# Altium project PATHOS_ControllerBoardExp.PrjPCB (part 2 of 2)

## Sheet PATHOS_SOM_CAN.SchDoc
size A4; CompanyName: NTB; Organization: NTB Interstate University of Applied; Address1: Werdenbergstrasse 4; Address3: 9471 Buchs; Address4: Switzerland; Organization1: Sciences of Technology Buchs; Size: A4
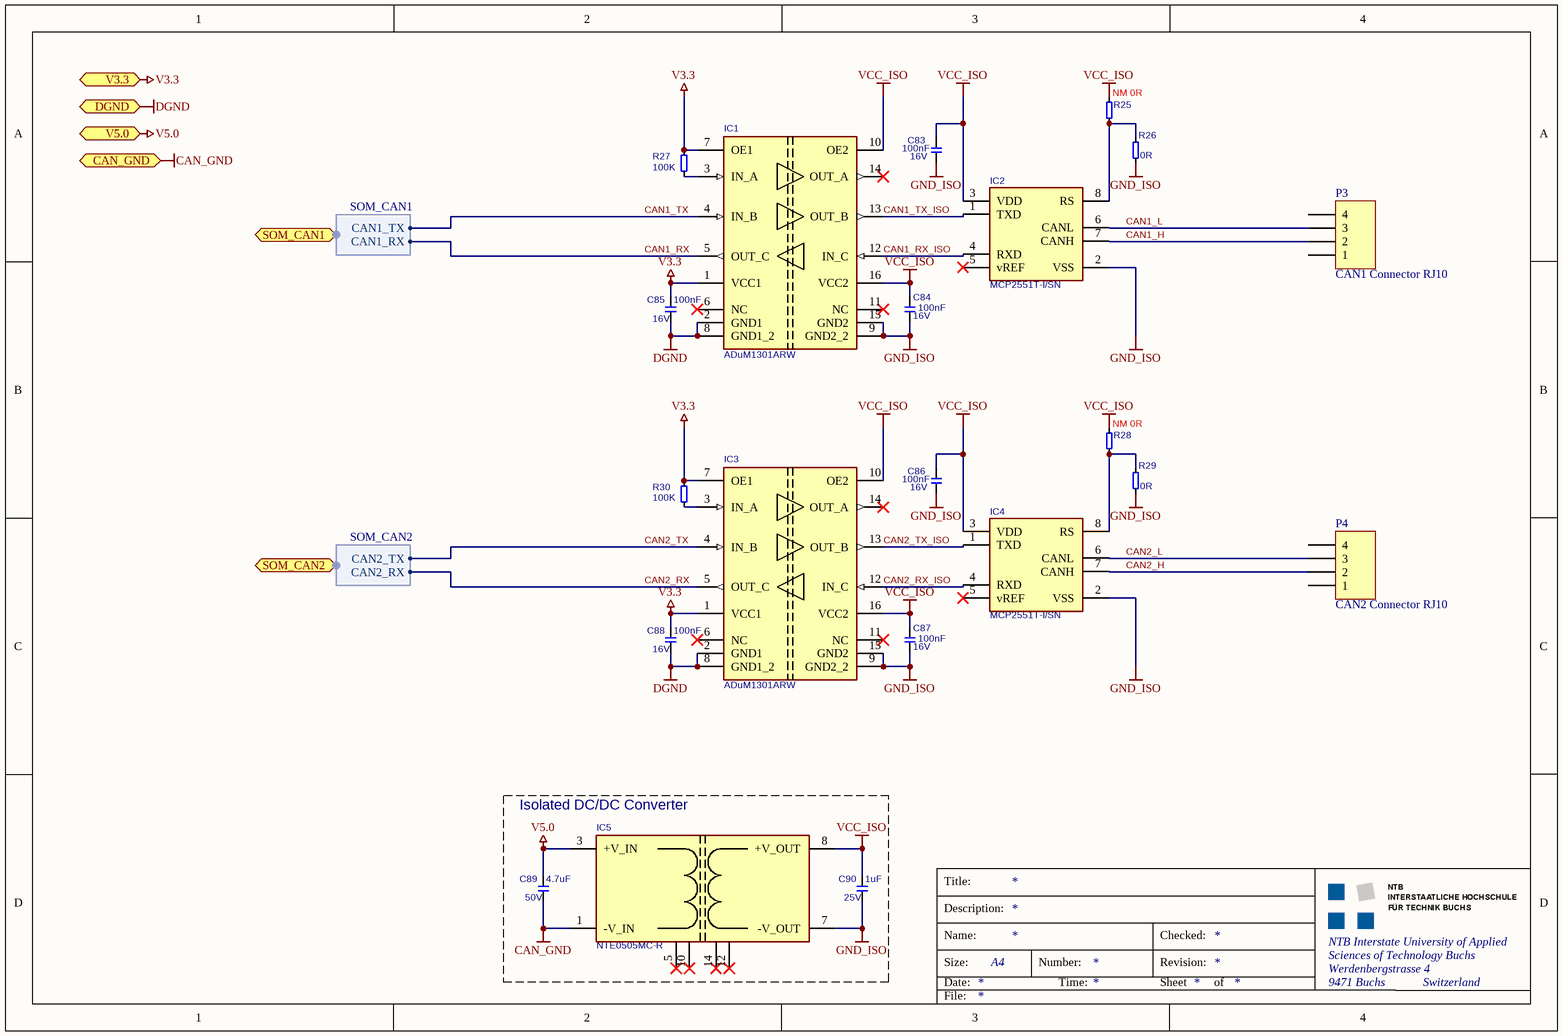
[diagram p12: PATHOS_SOM_CAN.SchDoc]

### Parts
C83  Rating: 16V  [0603_3D]  (hidden comment: 100nF)
C84  Rating: 16V  [0603_3D]  (hidden comment: 100nF)
C85  Rating: 16V  [0603_3D]  (hidden comment: 100nF)
C86  Rating: 16V  [0603_3D]  (hidden comment: 100nF)
C87  Rating: 16V  [0603_3D]  (hidden comment: 100nF)
C88  Rating: 16V  [0603_3D]  (hidden comment: 100nF)
C89  Rating: 50V  [1206]  (hidden comment: 4.7uF)
C90  Rating: 25V  [0603_3D]  (hidden comment: 1uF)
IC1  ADuM1301ARW  [T_AD_ADuM1300ARW]
IC2  MCP2551T-I/SN  [SOIC127P600X173-8N]
IC3  ADuM1301ARW  [T_AD_ADuM1300ARW]
IC4  MCP2551T-I/SN  [SOIC127P600X173-8N]
IC5  NTE0505MC-R  [T_MURATA_NTE0505MC-R]
P3  CAN1 Connector RJ10  [95009-2447]
P4  CAN2 Connector RJ10  [95009-2447]
R25  NM 0R  [0603_3D]
R26  0R  [0603_3D]
R27  100K  [0603_3D]
R28  NM 0R  [0603_3D]
R29  0R  [0603_3D]
R30  100K  [0603_3D]

### Blocks framed on the sheet
Isolated DC/DC Converter: C89 C90 IC5

### Ports
CAN_GND, DGND, SOM_CAN1 (harness SOM_CAN1), SOM_CAN2 (harness SOM_CAN2), V3.3, V5.0

### Harnesses
SOM_CAN1: CAN1_TX, CAN1_RX
SOM_CAN2: CAN2_TX, CAN2_RX

### Nets
CAN_GND: C89.1 IC5.1(-V_IN) ; port CAN_GND
DGND: C85.1 C88.1 IC1.2(GND1) IC1.8(GND1_2) IC3.2(GND1) IC3.8(GND1_2) ; port DGND
GND_ISO: C83.1 C84.1 C86.1 C87.1 C90.1 IC1.9(GND2_2) IC1.15(GND2) IC2.2(VSS) IC3.9(GND2_2) IC3.15(GND2) IC4.2(VSS) IC5.7(-V_OUT) R26.1 R29.1
V3.3: C85.2 C88.2 IC1.1(VCC1) IC1.7(OE1) IC3.1(VCC1) IC3.7(OE1) R27.2 R30.2 ; port V3.3
V5.0: C89.2 IC5.3(+V_IN) ; port V5.0
VCC_ISO: C83.2 C84.2 C86.2 C87.2 C90.2 IC1.10(OE2) IC1.16(VCC2) IC2.3(VDD) IC3.10(OE2) IC3.16(VCC2) IC4.3(VDD) IC5.8(+V_OUT) R25.2 R28.2
CAN1_H: IC2.7(CANH) P3.2
CAN1_L: IC2.6(CANL) P3.3
CAN1_RX: IC1.5(OUT_C) ; port SOM_CAN1.CAN1_RX
CAN1_RX_ISO: IC1.12(IN_C) IC2.4(RXD)
CAN1_TX: IC1.4(IN_B) ; port SOM_CAN1.CAN1_TX
CAN1_TX_ISO: IC1.13(OUT_B) IC2.1(TXD)
CAN2_H: IC4.7(CANH) P4.2
CAN2_L: IC4.6(CANL) P4.3
CAN2_RX: IC3.5(OUT_C) ; port SOM_CAN2.CAN2_RX
CAN2_RX_ISO: IC3.12(IN_C) IC4.4(RXD)
CAN2_TX: IC3.4(IN_B) ; port SOM_CAN2.CAN2_TX
CAN2_TX_ISO: IC3.13(OUT_B) IC4.1(TXD)
NetIC1_3: IC1.3(IN_A) R27.1
NetIC2_8: IC2.8(RS) R25.1 R26.2
NetIC3_3: IC3.3(IN_A) R30.1
NetIC4_8: IC4.8(RS) R28.1 R29.2

Not connected (* = marked no-connect by the designer): IC1 6(NC)* 11(NC)* 14(OUT_A)*; IC2 5(vREF)*; IC3 6(NC)* 11(NC)* 14(OUT_A)*; IC4 5(vREF)*; IC5 5(NC)* 10(NC)* 12(NC)* 14(NC)*; P3 1 4; P4 1 4

### Notes on the sheet
- Title:
- Description:
- Size:
- Date:
- Name:
- Number:
- Time:
- Revision:
- Sheet
- Checked:
- of
- File:

### Library data of the parts
C83-C90 = C-X7R-100nF-16V-10%-0603: Capacitor Ceramic X7R 100nF 16V 10% 0603; Tolerance: 10%; Type: X7R
  C83-C88: Value: 100nF
  C89: Value: 4.7uF
  C90: Value: 1uF
IC1 IC3 = IC-AD-ADuM1301ARW: Digital Isolator; Manufacturer Name: Analog Devices; Manufacturer Part No.: ADuM1301ARW
IC2 IC4 = IC-MC-MCP2551T-I/SN: High speed CAN Transceiver; Manufacturer Name: Microchip; Manufacturer Part No.: MCP2551T-I/SN
IC5 = IC-MUR-NTE0505MC-R: Isolated DC/DC Converter; Manufacturer Name: Murata; Manufacturer Part No.: NTE0505MC-R
P3 P4 = Header 4: Header, 4-Pin; LatestRevisionDate: 17-Jul-2002; LatestRevisionNote: Re-released for DXP Platform.; Publisher: Altium Limited
R25 R26 R28 R29 = R-0R-63mW-1%-0603: Resistor 0 ohm 63mW 1% 0603; Rating: 63mW; Tolerance: 1%; Value: 0R
R27 R30 = R-100KR-63mW-5%-0603: Resistor 100 Kohm 63mW 5% 0603; Value: 100KR; Rating: 63mW; Tolerance: 5%

## Sheet PATHOS_PowerSwitch.SchDoc: Power Switch Schematic
size A4; Author: A. Kalberer; CompanyName: NTB; Organization: NTB Interstate University of Applied; Address1: Werdenbergstrasse 4; Address3: 9471 Buchs; Address4: Switzerland; Organization1: Sciences of Technology Buchs; Size: A4; ShortDescription: Power-, Reset-, Recovery-Circuit
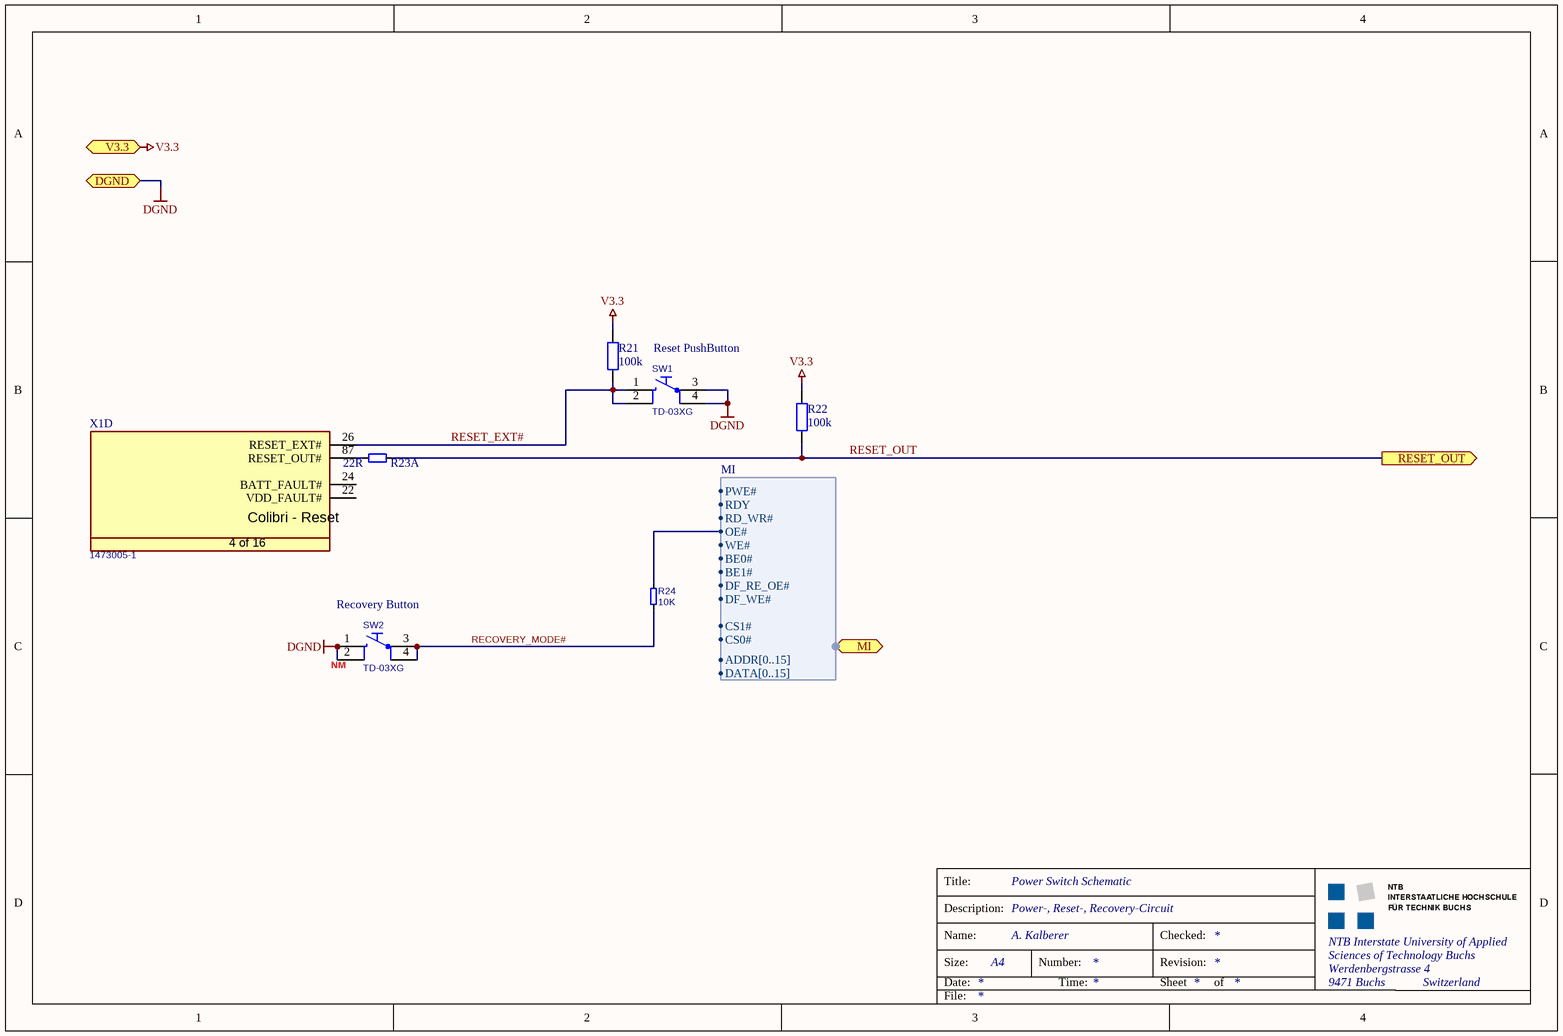
[diagram p13: PATHOS_PowerSwitch.SchDoc]

### Parts
R21  100k  [0603_3D]
R22  100k  [0603_3D]
R23  value 22R  [R_Array_CAT16-J4]  (hidden comment: R Array)  (part A of 4)
R24  10K  [0603_3D]
SW1  TD-03XG  [T_WMF_TD-03XG]
SW2  TD-03XG  [T_WMF_TD-03XG]
X1  Manufacturer Part No.: 1473005-1  [T_Tyco_1473005-1]  (hidden comment: CON-Tyco-1473005-1-200-0.6mm)  (part D of 16)

### Ports
DGND, MI (harness MI), RESET_OUT (out), V3.3

### Harnesses
MI: DATA[0..15], ADDR[0..15], CS0#, DF_WE#, DF_RE_OE#, BE1#, BE0#, WE#, OE#, RD_WR#, RDY, PWE#, CS1#

### Nets
DGND: SW1.3 SW1.4 SW2.1 SW2.2 ; port DGND
V3.3: R21.2 R22.2 ; port V3.3
MI.OE#: R24.2 ; port MI.OE#
RECOVERY_MODE#: R24.1 SW2.3 SW2.4
RESET_EXT#: R21.1 SW1.1 SW1.2 X1.26(RESET_EXT#)
RESET_OUT: R22.1 R23.1A ; port RESET_OUT
NetR23_2A: R23.2A X1.87(RESET_OUT#)

Not connected (* = marked no-connect by the designer): X1 22(VDD_FAULT#) 24(BATT_FAULT#)

### Notes on the sheet
- Reset PushButton
- (near SW2) Recovery Button
- (near SW2) NM
- Title:
- Description:
- Size:
- Date:
- Name:
- Number:
- Time:
- Revision:
- Sheet
- Checked:
- of
- File:
- (in symbol CON-Tyco-1473005-1-200-0.6mm, part D) Colibri - Reset; 4 of 16

### Library data of the parts
R21 R22 = R: Resistor; #Manufacturer: Generic Components; #Publisher: Dr. A. Heinzelmann; #Class: Passive; #Published: 2006-10-06; #ClassSub: Resistor; Type: *; Value: 100k
R23 = R_Array
R24 = R-10KR-63mW-5%-0603: Resistor 10 Kohm 63mW 5% 0603; Value: 10KR; Rating: 63mW; Tolerance: 5%
SW1 SW2 = SW-WMF-TD-03XG: Switch; Manufacturer Name: WMF; Rating: 50mA; Manufacturer Part No.: TD-03XG
X1 = CON-Tyco-1473005-1-200-0.6mm: SODIMM Connector; Manufacturer Name: Tyco; No. of ways: 200

## Sheet PATHOS_AnalogOut.SchDoc
size A4; CompanyName: NTB; Organization: NTB Interstate University of Applied; Address1: Werdenbergstrasse 4; Address3: 9471 Buchs; Address4: Switzerland; Organization1: Sciences of Technology Buchs; Size: A4
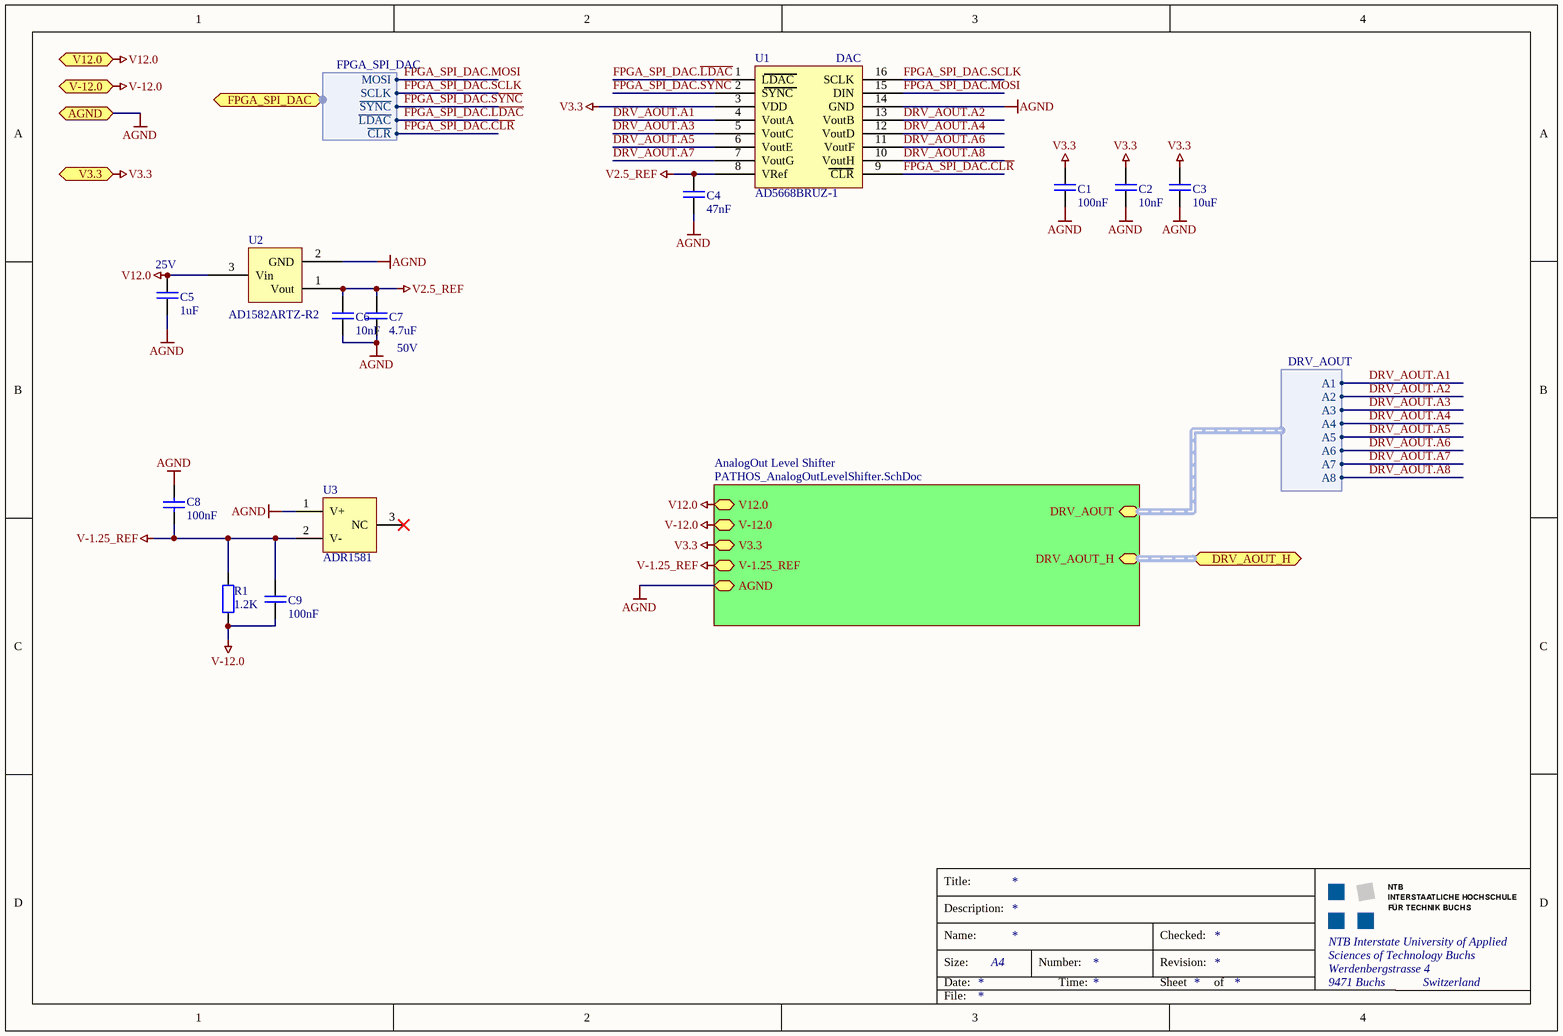
[diagram p14: PATHOS_AnalogOut.SchDoc]

### Parts
C1  100nF  [0603_3D]
C2  10nF  [0603_3D]
C3  10uF  [0603_3D]
C4  47nF  [0603_3D]
C5  Voltage Maximum: 25V  [0603_3D]  (hidden comment: 1uF)
C6  10nF  [0603_3D]
C7  Voltage Maximum: 50V  [1206]  (hidden comment: 4.7uF)
C8  100nF  [0603_3D]
C9  100nF  [0603_3D]
R1  1.2K  [0603]
U1  AD5668BRUZ-1  [TSSOP16-W]
U2  AD1582ARTZ-R2  [SOT23]
U3  ADR1581  [SOT23]

### Sub-sheets
AnalogOut Level Shifter = PATHOS_AnalogOutLevelShifter.SchDoc (file not in this document): DRV_AOUT_H (harness DRV_AOUT_H), V12.0, V-12.0, V3.3, AGND, V-1.25_REF, DRV_AOUT (harness DRV_AOUT)

### Ports
AGND, DRV_AOUT_H (harness DRV_AOUT_H), FPGA_SPI_DAC (harness FPGA_SPI_DAC), V3.3, V12.0, V-12.0

### Harnesses
FPGA_SPI_DAC: MOSI, SCLK, ~{SYNC}, ~{LDAC}, ~{CLR}
DRV_AOUT: A1, A2, A3, A4, A5, A6, A7, A8

### Nets
AGND: C1.2 C2.2 C3.2 C4.2 C5.1 C6.2 C7.2 C8.2 U1.14(GND) U2.2(GND) U3.1(V+) ; port AGND, sheet AnalogOut Level Shifter/AGND
V2.5_REF: C4.1 C6.1 C7.1 U1.8(VRef) U2.1(Vout)
V3.3: C1.1 C2.1 C3.1 U1.3(VDD) ; port V3.3, sheet AnalogOut Level Shifter/V3.3
V12.0: C5.2 U2.3(Vin) ; port V12.0, sheet AnalogOut Level Shifter/V12.0
V-1.25_REF: C8.1 C9.2 R1.2 U3.2(V-) ; sheet AnalogOut Level Shifter/V-1.25_REF
V-12.0: C9.1 R1.1 ; port V-12.0, sheet AnalogOut Level Shifter/V-12.0
DRV_AOUT.A1: U1.4(VoutA) ; sheet AnalogOut Level Shifter/DRV_AOUT.A1
DRV_AOUT.A2: U1.13(VoutB) ; sheet AnalogOut Level Shifter/DRV_AOUT.A2
DRV_AOUT.A3: U1.5(VoutC) ; sheet AnalogOut Level Shifter/DRV_AOUT.A3
DRV_AOUT.A4: U1.12(VoutD) ; sheet AnalogOut Level Shifter/DRV_AOUT.A4
DRV_AOUT.A5: U1.6(VoutE) ; sheet AnalogOut Level Shifter/DRV_AOUT.A5
DRV_AOUT.A6: U1.11(VoutF) ; sheet AnalogOut Level Shifter/DRV_AOUT.A6
DRV_AOUT.A7: U1.7(VoutG) ; sheet AnalogOut Level Shifter/DRV_AOUT.A7
DRV_AOUT.A8: U1.10(VoutH) ; sheet AnalogOut Level Shifter/DRV_AOUT.A8
FPGA_SPI_DAC.~{CLR}: U1.9(CLR) ; port FPGA_SPI_DAC.~{CLR}
FPGA_SPI_DAC.~{LDAC}: U1.1(LDAC) ; port FPGA_SPI_DAC.~{LDAC}
FPGA_SPI_DAC.MOSI: U1.15(DIN) ; port FPGA_SPI_DAC.MOSI
FPGA_SPI_DAC.~{SYNC}: U1.2(SYNC) ; port FPGA_SPI_DAC.~{SYNC}
FPGA_SPI_DAC.SCLK: U1.16(SCLK) ; port FPGA_SPI_DAC.SCLK

Not connected (* = marked no-connect by the designer): U3 3(NC)*

### Buses and harness runs
harness port DRV_AOUT_H = sheet AnalogOut Level Shifter/DRV_AOUT_H

### Notes on the sheet
- (near U1) DAC
- Title:
- Description:
- Size:
- Date:
- Name:
- Number:
- Time:
- Revision:
- Sheet
- Checked:
- of
- File:

### Library data of the parts
C1-C4 C6 C9 = C: Capacitor; #Manufacturer: Generic Components; #Publisher: Dr. A. Heinzelmann; #Class: Passive; Initial Voltage: 0V; Voltage Maximum: ??? V; #Published: 2006-10-07; #ClassSub: Capacitor
  C1 C9: Value: 100nF
  C2 C6: Value: 10nF
  C3: Value: 10uF
  C4: Value: 47nF
C5 C7 C8 = C: Capacitor; #Manufacturer: Generic Components; #Publisher: Dr. A. Heinzelmann; #Class: Passive; Initial Voltage: 0V; #Published: 2006-10-07; #ClassSub: Capacitor
  C5: Value: 1uF
  C7: Value: 4.7uF
  C8: Type: *; Value: 100nF; Voltage Maximum: *
R1 = R: Resistor; #Manufacturer: Generic Components; #Publisher: Dr. A. Heinzelmann; #Class: Passive; #Published: 2006-10-06; #ClassSub: Resistor; Value: 1.2K

## Nets that join several sheets
AGND: PATHOS_ControllerBoardExp (GND1.3), PATHOS_AnalogOut (11 pins)
CAN_GND: PATHOS_ControllerBoardExp (GND1.1), PATHOS_SOM_CAN (C89.1 IC5.1)
DGND: PATHOS_ControllerBoardExp (GND1.2), PATHOS_FPGA_Power (98 pins), PATHOS_FPGA_Clk (C10.1 Y1.2), PATHOS_FPGA_IO_Ext (11 pins), PATHOS_SOM_Power (27 pins), PATHOS_SOM_UART (6 pins), PATHOS_SOM_Ethernet (L2.1 L4.1), PATHOS_SOM_CAN (6 pins), PATHOS_PowerSwitch (SW1.3 SW1.4 SW2.1 SW2.2)
V3.3: PATHOS_FPGA_Power (38 pins), PATHOS_FPGA_Clk (C10.2 Y1.1 Y1.4), PATHOS_FPGA_IO_Ext (11 pins), PATHOS_SOM_Power (27 pins), PATHOS_SOM_UART (C114.2 U7.16), PATHOS_SOM_Ethernet (L3.1 P5.9 P5.12), PATHOS_SOM_CAN (8 pins), PATHOS_PowerSwitch (R21.2 R22.2), PATHOS_AnalogOut (C1.1 C2.1 C3.1 U1.3)
CAN1_RX: PATHOS_SOM_IO (R50.2B), PATHOS_SOM_CAN (IC1.5)
CAN1_TX: PATHOS_SOM_IO (R50.2A), PATHOS_SOM_CAN (IC1.4)
CAN2_RX: PATHOS_SOM_IO (R51.1A), PATHOS_SOM_CAN (IC3.5)
CAN2_TX: PATHOS_SOM_IO (R51.1B), PATHOS_SOM_CAN (IC3.4)
FPGA_Config_SOM.DATA0: PATHOS_FPGA_IO (U4.H2), PATHOS_SOM_IO (R46.1B)
FPGA_EXT.ENABLE_DRV: PATHOS_FPGA_IO (U4.G1), PATHOS_FPGA_IO_Ext (D5.3 RN3.8)
FPGA_EXT.ENC_A1: PATHOS_FPGA_IO (U4.L8), PATHOS_FPGA_IO_Ext (D2.3 RN1.1)
FPGA_EXT.ENC_A2: PATHOS_FPGA_IO (U4.T5), PATHOS_FPGA_IO_Ext (D2.1 RN1.3)
FPGA_EXT.ENC_A3: PATHOS_FPGA_IO (U4.T4), PATHOS_FPGA_IO_Ext (D1.3 RN1.5)
FPGA_EXT.ENC_A4: PATHOS_FPGA_IO (U4.T3), PATHOS_FPGA_IO_Ext (D1.1 RN1.7)
FPGA_EXT.ENC_A5: PATHOS_FPGA_IO (U4.P6), PATHOS_FPGA_IO_Ext (D4.3 RN2.1)
FPGA_EXT.ENC_A6: PATHOS_FPGA_IO (U4.N3), PATHOS_FPGA_IO_Ext (D4.1 RN2.3)
FPGA_EXT.ENC_A7: PATHOS_FPGA_IO (U4.N6), PATHOS_FPGA_IO_Ext (D3.3 RN2.5)
FPGA_EXT.ENC_A8: PATHOS_FPGA_IO (U4.M7), PATHOS_FPGA_IO_Ext (D3.1 RN2.7)
FPGA_EXT.ENC_B1: PATHOS_FPGA_IO (U4.M8), PATHOS_FPGA_IO_Ext (D2.4 RN1.2)
FPGA_EXT.ENC_B2: PATHOS_FPGA_IO (U4.R4), PATHOS_FPGA_IO_Ext (D2.6 RN1.4)
FPGA_EXT.ENC_B3: PATHOS_FPGA_IO (U4.R3), PATHOS_FPGA_IO_Ext (D1.4 RN1.6)
FPGA_EXT.ENC_B4: PATHOS_FPGA_IO (U4.T2), PATHOS_FPGA_IO_Ext (D1.6 RN1.8)
FPGA_EXT.ENC_B5: PATHOS_FPGA_IO (U4.P3), PATHOS_FPGA_IO_Ext (D4.4 RN2.2)
FPGA_EXT.ENC_B6: PATHOS_FPGA_IO (U4.N5), PATHOS_FPGA_IO_Ext (D4.6 RN2.4)
FPGA_EXT.ENC_B7: PATHOS_FPGA_IO (U4.M6), PATHOS_FPGA_IO_Ext (D3.4 RN2.6)
FPGA_EXT.ENC_B8: PATHOS_FPGA_IO (U4.L7), PATHOS_FPGA_IO_Ext (D3.6 RN2.8)
FPGA_EXT.IO_1: PATHOS_FPGA_IO (U4.P1), PATHOS_FPGA_IO_Ext (D11.3 RN6.1)
FPGA_EXT.IO_2: PATHOS_FPGA_IO (U4.P2), PATHOS_FPGA_IO_Ext (D11.4 RN6.2)
FPGA_EXT.IO_3: PATHOS_FPGA_IO (U4.N1), PATHOS_FPGA_IO_Ext (D11.1 RN6.3)
FPGA_EXT.IO_4: PATHOS_FPGA_IO (U4.N2), PATHOS_FPGA_IO_Ext (D11.6 RN6.4)
FPGA_EXT.IO_5: PATHOS_FPGA_IO (U4.L1), PATHOS_FPGA_IO_Ext (D10.3 RN6.5)
FPGA_EXT.IO_6: PATHOS_FPGA_IO (U4.L2), PATHOS_FPGA_IO_Ext (D10.4 RN6.6)
FPGA_EXT.IO_7: PATHOS_FPGA_IO (U4.K1), PATHOS_FPGA_IO_Ext (D10.1 RN6.7)
FPGA_EXT.IO_8: PATHOS_FPGA_IO (U4.K2), PATHOS_FPGA_IO_Ext (D10.6 RN6.8)
FPGA_EXT.PWM_1: PATHOS_FPGA_IO (U4.A2), PATHOS_FPGA_IO_Ext (D8.6 RN5.8)
FPGA_EXT.PWM_2: PATHOS_FPGA_IO (U4.B3), PATHOS_FPGA_IO_Ext (D8.1 RN5.7)
FPGA_EXT.PWM_3: PATHOS_FPGA_IO (U4.A3), PATHOS_FPGA_IO_Ext (D8.4 RN5.6)
FPGA_EXT.PWM_4: PATHOS_FPGA_IO (U4.B4), PATHOS_FPGA_IO_Ext (D8.3 RN5.5)
FPGA_EXT.PWM_5: PATHOS_FPGA_IO (U4.A4), PATHOS_FPGA_IO_Ext (D9.6 RN5.4)
FPGA_EXT.PWM_6: PATHOS_FPGA_IO (U4.B5), PATHOS_FPGA_IO_Ext (D9.1 RN5.3)
FPGA_EXT.PWM_7: PATHOS_FPGA_IO (U4.A5), PATHOS_FPGA_IO_Ext (D9.4 RN5.2)
FPGA_EXT.PWM_8: PATHOS_FPGA_IO (U4.A6), PATHOS_FPGA_IO_Ext (D9.3 RN5.1)
FPGA_EXT.READY_DRV_1: PATHOS_FPGA_IO (U4.G2), PATHOS_FPGA_IO_Ext (D5.4 RN3.7)
FPGA_EXT.READY_DRV_2: PATHOS_FPGA_IO (U4.F1), PATHOS_FPGA_IO_Ext (D5.1 RN3.6)
FPGA_EXT.READY_DRV_3: PATHOS_FPGA_IO (U4.F2), PATHOS_FPGA_IO_Ext (D5.6 RN3.5)
FPGA_EXT.READY_DRV_4: PATHOS_FPGA_IO (U4.D1), PATHOS_FPGA_IO_Ext (D6.4 RN3.4)
FPGA_EXT.READY_DRV_5: PATHOS_FPGA_IO (U4.D2), PATHOS_FPGA_IO_Ext (D6.6 RN3.3)
FPGA_EXT.READY_DRV_6: PATHOS_FPGA_IO (U4.C1), PATHOS_FPGA_IO_Ext (D6.1 RN3.2)
FPGA_EXT.READY_DRV_7: PATHOS_FPGA_IO (U4.C2), PATHOS_FPGA_IO_Ext (D6.3 RN3.1)
FPGA_EXT.READY_DRV_8: PATHOS_FPGA_IO (U4.B1), PATHOS_FPGA_IO_Ext (D7.6 RN4.8)
FPGA_SPI_DAC.~{CLR}: PATHOS_FPGA_IO (U4.R5), PATHOS_AnalogOut (U1.9)
FPGA_SPI_DAC.~{LDAC}: PATHOS_FPGA_IO (U4.R6), PATHOS_AnalogOut (U1.1)
FPGA_SPI_DAC.MOSI: PATHOS_FPGA_IO (U4.T7), PATHOS_AnalogOut (U1.15)
FPGA_SPI_DAC.~{SYNC}: PATHOS_FPGA_IO (U4.T6), PATHOS_AnalogOut (U1.2)
FPGA_SPI_DAC.SCLK: PATHOS_FPGA_IO (U4.R7), PATHOS_AnalogOut (U1.16)
MI.ADDR0: PATHOS_FPGA_MemoryInterface (U4.J15), PATHOS_SOM_IO (R42.1A)
MI.ADDR1: PATHOS_FPGA_MemoryInterface (U4.J16), PATHOS_SOM_IO (R42.1B)
MI.ADDR2: PATHOS_FPGA_MemoryInterface (U4.J13), PATHOS_SOM_IO (R42.1C)
MI.ADDR3: PATHOS_FPGA_MemoryInterface (U4.J14), PATHOS_SOM_IO (R42.1D)
MI.ADDR4: PATHOS_FPGA_MemoryInterface (U4.L13), PATHOS_SOM_IO (R43.1A)
MI.ADDR5: PATHOS_FPGA_MemoryInterface (U4.L14), PATHOS_SOM_IO (R43.1B)
MI.ADDR6: PATHOS_FPGA_MemoryInterface (U4.N15), PATHOS_SOM_IO (R43.1C)
MI.ADDR7: PATHOS_FPGA_MemoryInterface (U4.N16), PATHOS_SOM_IO (R43.1D)
MI.ADDR8: PATHOS_FPGA_MemoryInterface (U4.K16), PATHOS_SOM_IO (R45.1B)
MI.ADDR9: PATHOS_FPGA_MemoryInterface (U4.K15), PATHOS_SOM_IO (R45.1A)
MI.ADDR10: PATHOS_FPGA_MemoryInterface (U4.N14), PATHOS_SOM_IO (R44.1D)
MI.ADDR11: PATHOS_FPGA_MemoryInterface (U4.P16), PATHOS_SOM_IO (R44.1C)
MI.ADDR12: PATHOS_FPGA_MemoryInterface (U4.P15), PATHOS_SOM_IO (R44.1B)
MI.ADDR13: PATHOS_FPGA_MemoryInterface (U4.R16), PATHOS_SOM_IO (R44.1A)
MI.ADDR14: PATHOS_FPGA_MemoryInterface (U4.L15), PATHOS_SOM_IO (R47.1A)
MI.ADDR15: PATHOS_FPGA_MemoryInterface (U4.L16), PATHOS_SOM_IO (R47.1B)
MI.BE0#: PATHOS_FPGA_MemoryInterface (U4.D15), PATHOS_SOM_IO (R47.1C)
MI.BE1#: PATHOS_FPGA_MemoryInterface (U4.C16), PATHOS_SOM_IO (R47.1D)
MI.CS0#: PATHOS_FPGA_MemoryInterface (U4.G15), PATHOS_SOM_IO (R49.1C)
MI.CS1#: PATHOS_FPGA_MemoryInterface (U4.G16), PATHOS_SOM_IO (R49.1D)
MI.DATA0: PATHOS_FPGA_MemoryInterface (U4.T15), PATHOS_SOM_IO (R38.1A)
MI.DATA1: PATHOS_FPGA_MemoryInterface (U4.P14), PATHOS_SOM_IO (R38.1B)
MI.DATA2: PATHOS_FPGA_MemoryInterface (U4.R14), PATHOS_SOM_IO (R38.1C)
MI.DATA3: PATHOS_FPGA_MemoryInterface (U4.T14), PATHOS_SOM_IO (R38.1D)
MI.DATA4: PATHOS_FPGA_MemoryInterface (U4.R13), PATHOS_SOM_IO (R39.1A)
MI.DATA5: PATHOS_FPGA_MemoryInterface (U4.T13), PATHOS_SOM_IO (R39.1B)
MI.DATA6: PATHOS_FPGA_MemoryInterface (U4.N12), PATHOS_SOM_IO (R39.1C)
MI.DATA7: PATHOS_FPGA_MemoryInterface (U4.R12), PATHOS_SOM_IO (R39.1D)
MI.DATA8: PATHOS_FPGA_MemoryInterface (U4.T12), PATHOS_SOM_IO (R40.1A)
MI.DATA9: PATHOS_FPGA_MemoryInterface (U4.N11), PATHOS_SOM_IO (R40.1B)
MI.DATA10: PATHOS_FPGA_MemoryInterface (U4.P11), PATHOS_SOM_IO (R40.1C)
MI.DATA11: PATHOS_FPGA_MemoryInterface (U4.R11), PATHOS_SOM_IO (R40.1D)
MI.DATA12: PATHOS_FPGA_MemoryInterface (U4.T11), PATHOS_SOM_IO (R41.1A)
MI.DATA13: PATHOS_FPGA_MemoryInterface (U4.R10), PATHOS_SOM_IO (R41.1B)
MI.DATA14: PATHOS_FPGA_MemoryInterface (U4.T10), PATHOS_SOM_IO (R41.1C)
MI.DATA15: PATHOS_FPGA_MemoryInterface (U4.P9), PATHOS_SOM_IO (R41.1D)
MI.DF_RE_OE#: PATHOS_FPGA_MemoryInterface (U4.C15), PATHOS_SOM_IO (R50.1D)
MI.DF_WE#: PATHOS_FPGA_MemoryInterface (U4.B16), PATHOS_SOM_IO (R50.1C)
MI.OE#: PATHOS_FPGA_MemoryInterface (U4.F13), PATHOS_SOM_IO (R23.1C), PATHOS_PowerSwitch (R24.2)
MI.PWE#: PATHOS_FPGA_MemoryInterface (U4.F16), PATHOS_SOM_IO (R49.1B)
MI.RD_WR#: PATHOS_FPGA_MemoryInterface (U4.F14), PATHOS_SOM_IO (R23.1D)
MI.RDY: PATHOS_FPGA_MemoryInterface (U4.F15), PATHOS_SOM_IO (R49.1A)
MI.WE#: PATHOS_FPGA_MemoryInterface (U4.D16), PATHOS_SOM_IO (R23.1B)
RESET_OUT: PATHOS_FPGA_IO (U4.A15), PATHOS_PowerSwitch (R22.1 R23.1A)
SPI_SOM_FPGA.CLK: PATHOS_FPGA_IO (U4.C14), PATHOS_SOM_IO (R48.1C)
SPI_SOM_FPGA.CS: PATHOS_FPGA_IO (U4.D14), PATHOS_SOM_IO (R48.1D)
SPI_SOM_FPGA.RXD: PATHOS_FPGA_IO (U4.B14), PATHOS_SOM_IO (R48.1B)
SPI_SOM_FPGA.TXD: PATHOS_FPGA_IO (U4.A14), PATHOS_SOM_IO (R48.1A)